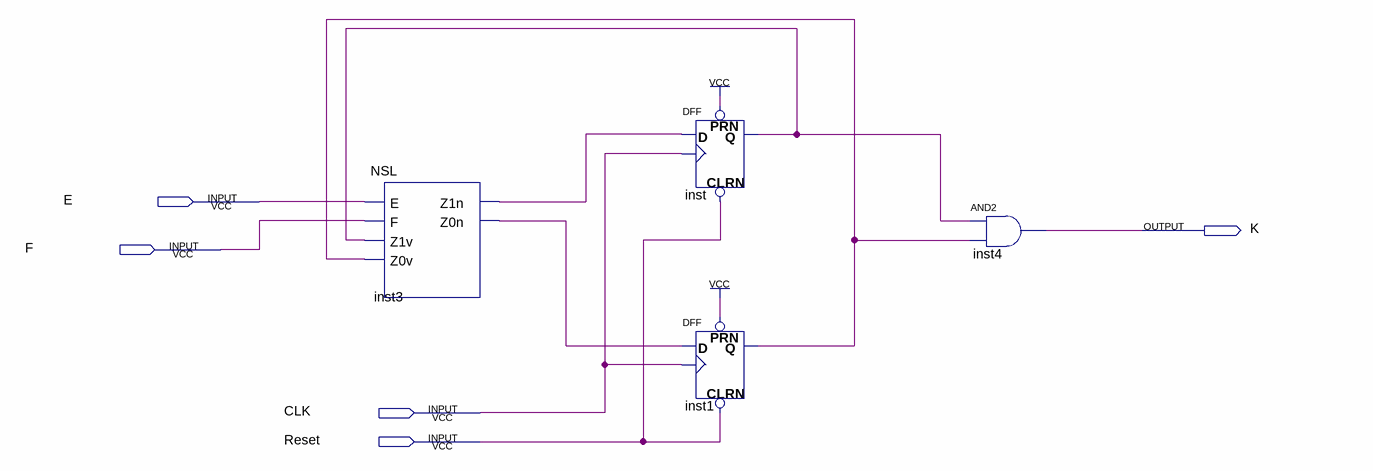
[diagram p0: schematic sheet]
// Quartus schematic ColaAutomat.bdf as structural Verilog: 4 symbols, 5 pins
module ColaAutomat (
  input  E,
  input  F,
  input  CLK,
  input  Reset,
  output K
);

  wire inst1_q, inst3_z0n, inst3_z1n, inst_q;

  NSL inst3 (.E(E), .F(F), .Z1v(inst_q), .Z0v(inst1_q), .Z1n(inst3_z1n), .Z0n(inst3_z0n));
  DFF inst (.CLRN(Reset), .CLK(CLK), .D(inst3_z1n), .PRN(1'b1), .Q(inst_q));
  DFF inst1 (.CLRN(Reset), .CLK(CLK), .D(inst3_z0n), .PRN(1'b1), .Q(inst1_q));
  and inst4 (K, inst_q, inst1_q);
endmodule
